# Altium schematic sheet RS485.SchDoc
size A4; DocumentNumber: 9; SheetNumber: 9; SheetTotal: 16
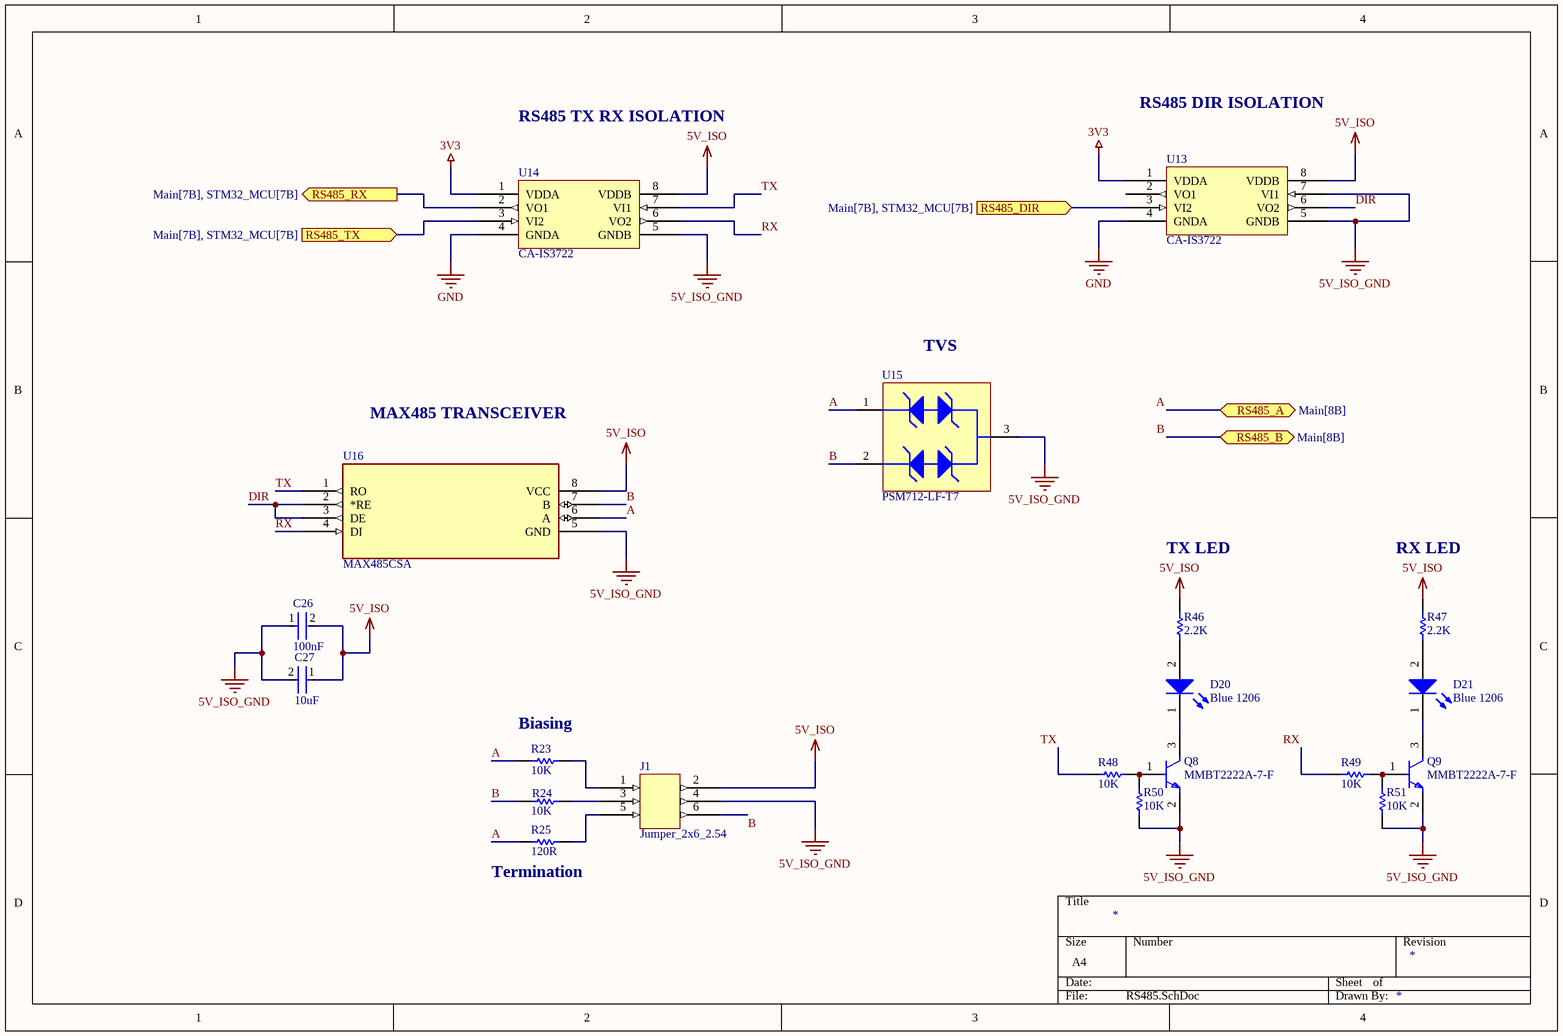
[diagram p0: RS485.SchDoc]

## Parts
C26  100nF  [FP-CGA3E-0_3-0_1-IPC_A]
C27  10uF  [FP-GRM188-0_1-e0_2_0_55-IPC_A]
D20  Blue 1206  [WL-SMCW_1206_150120xx75000]
D21  Blue 1206  [WL-SMCW_1206_150120xx75000]
J1  Jumper_2x6_2.54  [Jumper_2x6_2.54]
Q8  MMBT2222A-7-F  [FP-SOT23-IPC_A]
Q9  MMBT2222A-7-F  [FP-SOT23-IPC_A]
R23  10K  [RESC1609X55X30LL15T15]
R24  10K  [RESC1609X55X30LL15T15]
R25  120R  [RESC1609X55X30ML15T15]
R46  2.2K  [RESC1608X55X30NL15T15]
R47  2.2K  [RESC1608X55X30NL15T15]
R48  10K  [RESC1609X55X30LL15T15]
R49  10K  [RESC1609X55X30LL15T15]
R50  10K  [RESC1609X55X30LL15T15]
R51  10K  [RESC1609X55X30LL15T15]
U13  CA-IS3722  [CA-IS3722HS]
U14  CA-IS3722  [CA-IS3722HS]
U15  PSM712-LF-T7  [PRKT-SOT23-3_V]
U16  MAX485CSA  [21-0041B_8]

## Ports
RS485_A (bidir, see Main[8B]), RS485_B (bidir, see Main[8B]), RS485_DIR (in, see Main[7B], STM32_MCU[7B]), RS485_RX (out, see Main[7B], STM32_MCU[7B]), RS485_TX (in, see Main[7B], STM32_MCU[7B])

## Nets
3V3: U13.1(VDDA) U14.1(VDDA)
5V_ISO: C26.2 C27.1 J1.2 R46.1 R47.1 U13.8(VDDB) U14.8(VDDB) U16.8(VCC)
5V_ISO_GND: C26.1 C27.2 J1.4 Q8.2(E) Q9.2(E) R50.1 R51.1 U13.5(GNDB) U13.7(VI1) U14.5(GNDB) U15.3 U16.5(GND)
GND: U13.4(GNDA) U14.4(GNDA)
A: R23.2 R25.1 U15.1 U16.6(A) ; port RS485_A
B: J1.6 R24.2 U15.2 U16.7(B) ; port RS485_B
DIR: U13.6(VO2) U16.2(*RE) U16.3(DE)
RS485_DIR: U13.3(VI2) ; port RS485_DIR
RS485_RX: U14.2(VO1) ; port RS485_RX
RS485_TX: U14.3(VI2) ; port RS485_TX
RX: R49.2 U14.6(VO2) U16.4(DI)
TX: R48.2 U14.7(VI1) U16.1(RO)
NetD20_1: D20.1(K) Q8.3(C)
NetD20_2: D20.2(A) R46.2
NetD21_1: D21.1(K) Q9.3(C)
NetD21_2: D21.2(A) R47.2
NetJ1_1: J1.1 R23.1
NetJ1_3: J1.3 R24.1
NetJ1_5: J1.5 R25.2
NetQ8_1: Q8.1(B) R48.1 R50.2
NetQ9_1: Q9.1(B) R49.1 R51.2

Not connected (* = marked no-connect by the designer): U13 2(VO1)

## Notes on the sheet
- RS485 DIR ISOLATION
- RS485 TX RX ISOLATION
- TVS
- MAX485 TRANSCEIVER
- TX LED
- RX LED
- (near R23) Biasing
- (near R25) Termination

## Library data of the parts
C26 = CMP-2000-07546-2: Cap Ceramic 100nF 50V X7R 10% Pad SMD 0603 +125°C Automotive T/R; Weight: 7.1E-05oz; Composition: Ceramic; Max Operating Temperature: 125°C; Termination: SMD/SMT; Dielectric: X7R; Length: 1.6mm; Package Quantity: 1; REACH SVHC: No SVHC; Lead Free: Lead Free; Case Code (Metric): 1608; Min Operating Temperature: -55°C; Packaging: Tape and Reel; Tolerance: 10%; Voltage Rating: 50V; Case Code (Imperial): 0603; Capacitance: 100nF; Case/Package: 0603; Voltage Rating (DC): 50V; Depth: 0.8mm; Radiation Hardening: No; Ratings: AEC-Q200; Mount: Surface Mount; Voltage: 50V; Thickness: 0.035inch; Width: 0.8mm; Height: 0.8mm
C27 = CMP-2006-02792-2: Chip Multilayer Ceramic Capacitors for General Purpose, 0603, 10uF, X5R, 15%, 20%, 6.3V; Packaging: Tape and Reel; Voltage Rating (DC): 6.3V; Width: 0.031inch; Termination: SMD/SMT; Dielectric: X5R; Package Quantity: 4000; Voltage Rating: 6.3V; Capacitance: 10uF; Case/Package: 0603; Min Operating Temperature: -55°C; Voltage: 6.3V; Length: 1.6mm; Thickness: 0.035inch; Lead Free: Lead Free; Depth: 0.8mm; Case Code (Imperial): 0603; Max Operating Temperature: 85°C; Material: Ceramic; Height: 0.8mm; Tolerance: 20%; Mount: Surface Mount; REACH SVHC: No SVHC; Radiation Hardening: No; Case Code (Metric): 1608
D20 D21 = CMP-1426-00015-3: WL-SMCW SMT Mono-Color Chip LED Waterclear; Manufacturer Package Identifier: LED_1206; Dominant Wavelength: 470nm; Lens Style: Clear, Rectangular; Test Current: 20mA; Forward Voltage: 3.2V; Forward Current: 100mA; Peak Wavelength: 465nm; Max Reverse Voltage (DC): 5V; Viewing Angle: 140°; Luminous Intensity: 145mcd; Max Operating Temperature: 85°C; Case Code (Imperial): 1206; Length: 3.2mm; Width: 1.6mm; Min Operating Temperature: -40°C; Height: 680µm; Case Code (Metric): 3216; Packaging: Tape and Reel; RoHS: Compliant; Case/Package: 1206; REACH SVHC: Unknown; Wavelength: 470nm; Mount: Surface Mount; Color: Blue
Q8 Q9 = CMP-1693-00003-4: TRANS NPN 40V 0.6A SMD SOT23-3; Number of Elements: 1; Frequency: 300MHz; Max Collector Current: 600mA; Collector Base Voltage (VCBO): 75V; Current: 1A; Element Configuration: Single; Power Dissipation: 350mW; hFE Min: 100; Collector Emitter Saturation Voltage: 1V; Max Power Dissipation: 300mW; Emitter Base Voltage (VEBO): 6V; Voltage: 40V; Collector Emitter Breakdown Voltage: 40V; Width: 1.4mm; Polarity: NPN; Termination: SMD/SMT; Max Operating Temperature: 150°C; Transition Frequency: 300MHz; Contact Plating: Tin; Mount: Surface Mount; Max Frequency: 300MHz; Case/Package: SOT-23; Gain Bandwidth Product: 300MHz; Lead Free: Lead Free; Collector Emitter Voltage (VCEO): 40V; Radiation Hardening: No; Voltage Rating (DC): 40V; Height: 1mm; Max Breakdown Voltage: 40V; Packaging: Tape and Reel; Length: 3.05mm; Min Operating Temperature: -55°C; Weight: 0.000282oz; Current Rating: 600mA; REACH SVHC: No SVHC; Package Quantity: 3000; Continuous Collector Current: 600mA; Number of Pins: 3
R23 R24 R48-R51 = CMP-1012-00623-3: Chip Resistor, 10 KOhm, +/- 1%, 0.1 W, -55 to 155 degC, 0603 (1608 Metric), RoHS, Tape and Reel; Manufacturer: Panasonic; Voltage Rating: 75V; Case\/Package: 0603; Power Rating: 100mW; Resistance: 10KOhm; Temperature Coefficient: 100ppm\/degreesC; Number of Pins: 2; Package Reference: 603; Depth: 0.8mm; Mount: SurfaceMount; Package Description: 2-Pin Surface Mount Device, Body 1.6 x 0.85 mm; Datasheet Version: 02/2017; Length: 1.6mm; Lead Free: LeadFree; Height: 0.45mm; Number of Terminations: 2; Max Power Dissipation: 100mW; Min Operating Temperature: -55degC; Datasheet URL: https://industrial.panasonic.com/cdbs/www-data/pdf/RDA0000/AOA0000C304.pdf; Termination: SMD/SMT; Case Code (Metric): 1608; Case Code (Imperial): 0603; Tolerance: 1%; Max Operating Temperature: 155degC; RoHSCompliant: true; Voltage Rating (DC): 75V; Radiation Hardening: No; Packaging: TapeandReel; Composition: ThickFilm; Mounting Technology: SurfaceMount; Manufacturer URL: http://www.panasonic.com/; Width: 0.031inch; REACH SVHC: NoSVHC; Contact Plating: Tin; Military Standard: Not; Package Quantity: 1
R25 = CMP-2000-00213-2: Chip Resistor, 120 Ohm, +/- 1%, 0.1 W, -55 to 155 degC, 0603 (1608 Metric), RoHS, Tape and Reel; Manufacturer: Panasonic; Power Rating: 100mW; Voltage Rating (DC): 75V; Resistance: 120Ohm; Temperature Coefficient: 100ppm/degreesC; Number of Terminations: 2; Military Standard: Not; Tolerance: 1%; Min Operating Temperature: -55degC; Packaging: TapeandReel; Lead Free: LeadFree; Max Operating Temperature: 155degC; Manufacturer URL: http://www.panasonic.com/; Case Code (Imperial): 0603; REACH SVHC: NoSVHC; Width: 0.031inch; Datasheet URL: https://industrial.panasonic.com/cdbs/www-data/pdf/RDA0000/AOA0000C283.pdf; RoHSCompliant: true; Max Power Dissipation: 100mW; Termination: SMD/SMT; Package Reference: 0603; Height: 0.022inch; Depth: 0.8mm; Package Description: 2-Pin Surface Mount Device, Body 1.6 x 0.85 mm; Contact Plating: Tin; Length: 1.6mm; Package URL: http://www.st.com/st-web-ui/static/active/en/resource/technical/document/datasheet/CD00001320.pdf; Radiation Hardening: No; Package Quantity: 1; Number of Pins: 2; Datasheet Version: 42095.0; Voltage Rating: 75V; Composition: ThickFilm; Case/Package: 0603; Mount: SurfaceMount; Case Code (Metric): 1608
R46 R47 = CMP-1012-00586-3: Precision Thick Film Chip Resistor, 4.7 KOhm, +/- 1%, -55 to 155 degC, 0603 (1608 Metric), RoHS, Tape and Reel; Resistance: 220 Ohm; Voltage Rating: 50 V; Elements: 4; Case\Package: 1205; Tolerance: 5%; Power Rating: 250 mW; PackageReference: 0603; Max Operating Temperature: 125 degC; REACH SVHC: No SVHC; Width: 0.063 inch; Length: 0.126 inch; Height: 0.024 inch; Mount: Surface Mount; Package Quantity: 1; DatasheetVersion: Apr-15; ComponentLink1Description: Manufacturer URL; Min Operating Temperature: -55 degC; Packaging: Tape and Reel; Radiation Hardening: No; ComponentLink2URL: http://industrial.panasonic.com/cdbs/www-data/pdf/RDA0000/AOA0000C86.pdf; Case Code (Metric): 3216; Pins: 8; Case Code (Imperial): 1206; Type (Resistor): Thick Film; RoHSCompliant: true; ComponentLink2Description: Datasheet; PackageDescription: 2-Pin Surface Mount Device, Body 1.6 x 0.85 mm; ComponentLink1URL: http://www.panasonic.com/
U13 U14 = CA-IS3722: Dual Channel Standard Digital Isolators
U15 = CMP-2000-07553-1: TVS Array - Asymmetrical Data Line Protector, 600 W, 7.5 V, -55 to 150 degC, 3-Pin SOT23, RoHS, Tape and Reel; Manufacturer: Protek Devices; Min Breakdown Voltage: 7.5V; Direction: Bidirectional; Capacitance: 75pF; Current: 20uA; Power Dissipation: 600W; Working Voltage: 7V; Voltage: 12V; Case\/Package: SOT-23; Clamping Voltage: 17V; Element Configuration: Dual; Mounting Technology: SurfaceMount; RoHSCompliant: True; Radiation Hardening: No; Depth: 1.4mm; Lead Free: LeadFree; Package Description: 3-Pin Small Outline Transistor, Body 2.92 x 1.3 mm, Pitch 0.94 mm; Max Operating Temperature: 150degC; Length: 3.04mm; Manufacturer URL: http://www.protekdevices.com/; Min Operating Temperature: -55degC; Leakage Current: 20uA; Datasheet URL: www.protekdevices.com/xyz/documents/datasheets/psm712.pdf; Packaging: TapeandReel; Datasheet Version: 10/2013; Package Reference: SOT23-3; Number of Pins: 3
U16 = MAX485CSA: Low-Power, Slew-Rate-Limited RS-485/RS-422 Transceivers; MF: Analog Devices; MP: MAX485CSA+; SnapEDA_Link: https://www.snapeda.com/parts/MAX485CSA+/Analog+Devices/view-part/?ref=snap; Package: SOIC-8 Maxim; Value: *; Check_prices: https://www.snapeda.com/parts/MAX485CSA+/Analog+Devices/view-part/?ref=eda